# Altium schematic sheet ATmega324PB_Xplained_Pro_TopLevel.SchDoc: Top Level Schematics
size A3; Organization: ATMEL Norway; Address1: Vestre Rosten 79; Address2: N-7075 TILLER; Address3: NORWAY; DocumentNumber: A09-2589; Revision: 1; SheetNumber: 1; SheetTotal: 5; PageSetup: Record=PageOptions|CenterHorizontal=True|CenterVertical=True|PrintScale=1.01|XCorrection=1.00|YCorrection=1.00|PrintKind=1|BorderSize=5000000|LeftOffset=0|BottomOffset=0|Orientation=2|PaperLength=1000|PaperWidth=1000|Scale=100|PaperSource=7|PrintQuality=-4|MediaType=1|DitherType=10|PaperKind=Letter|PrintScaleMode=1
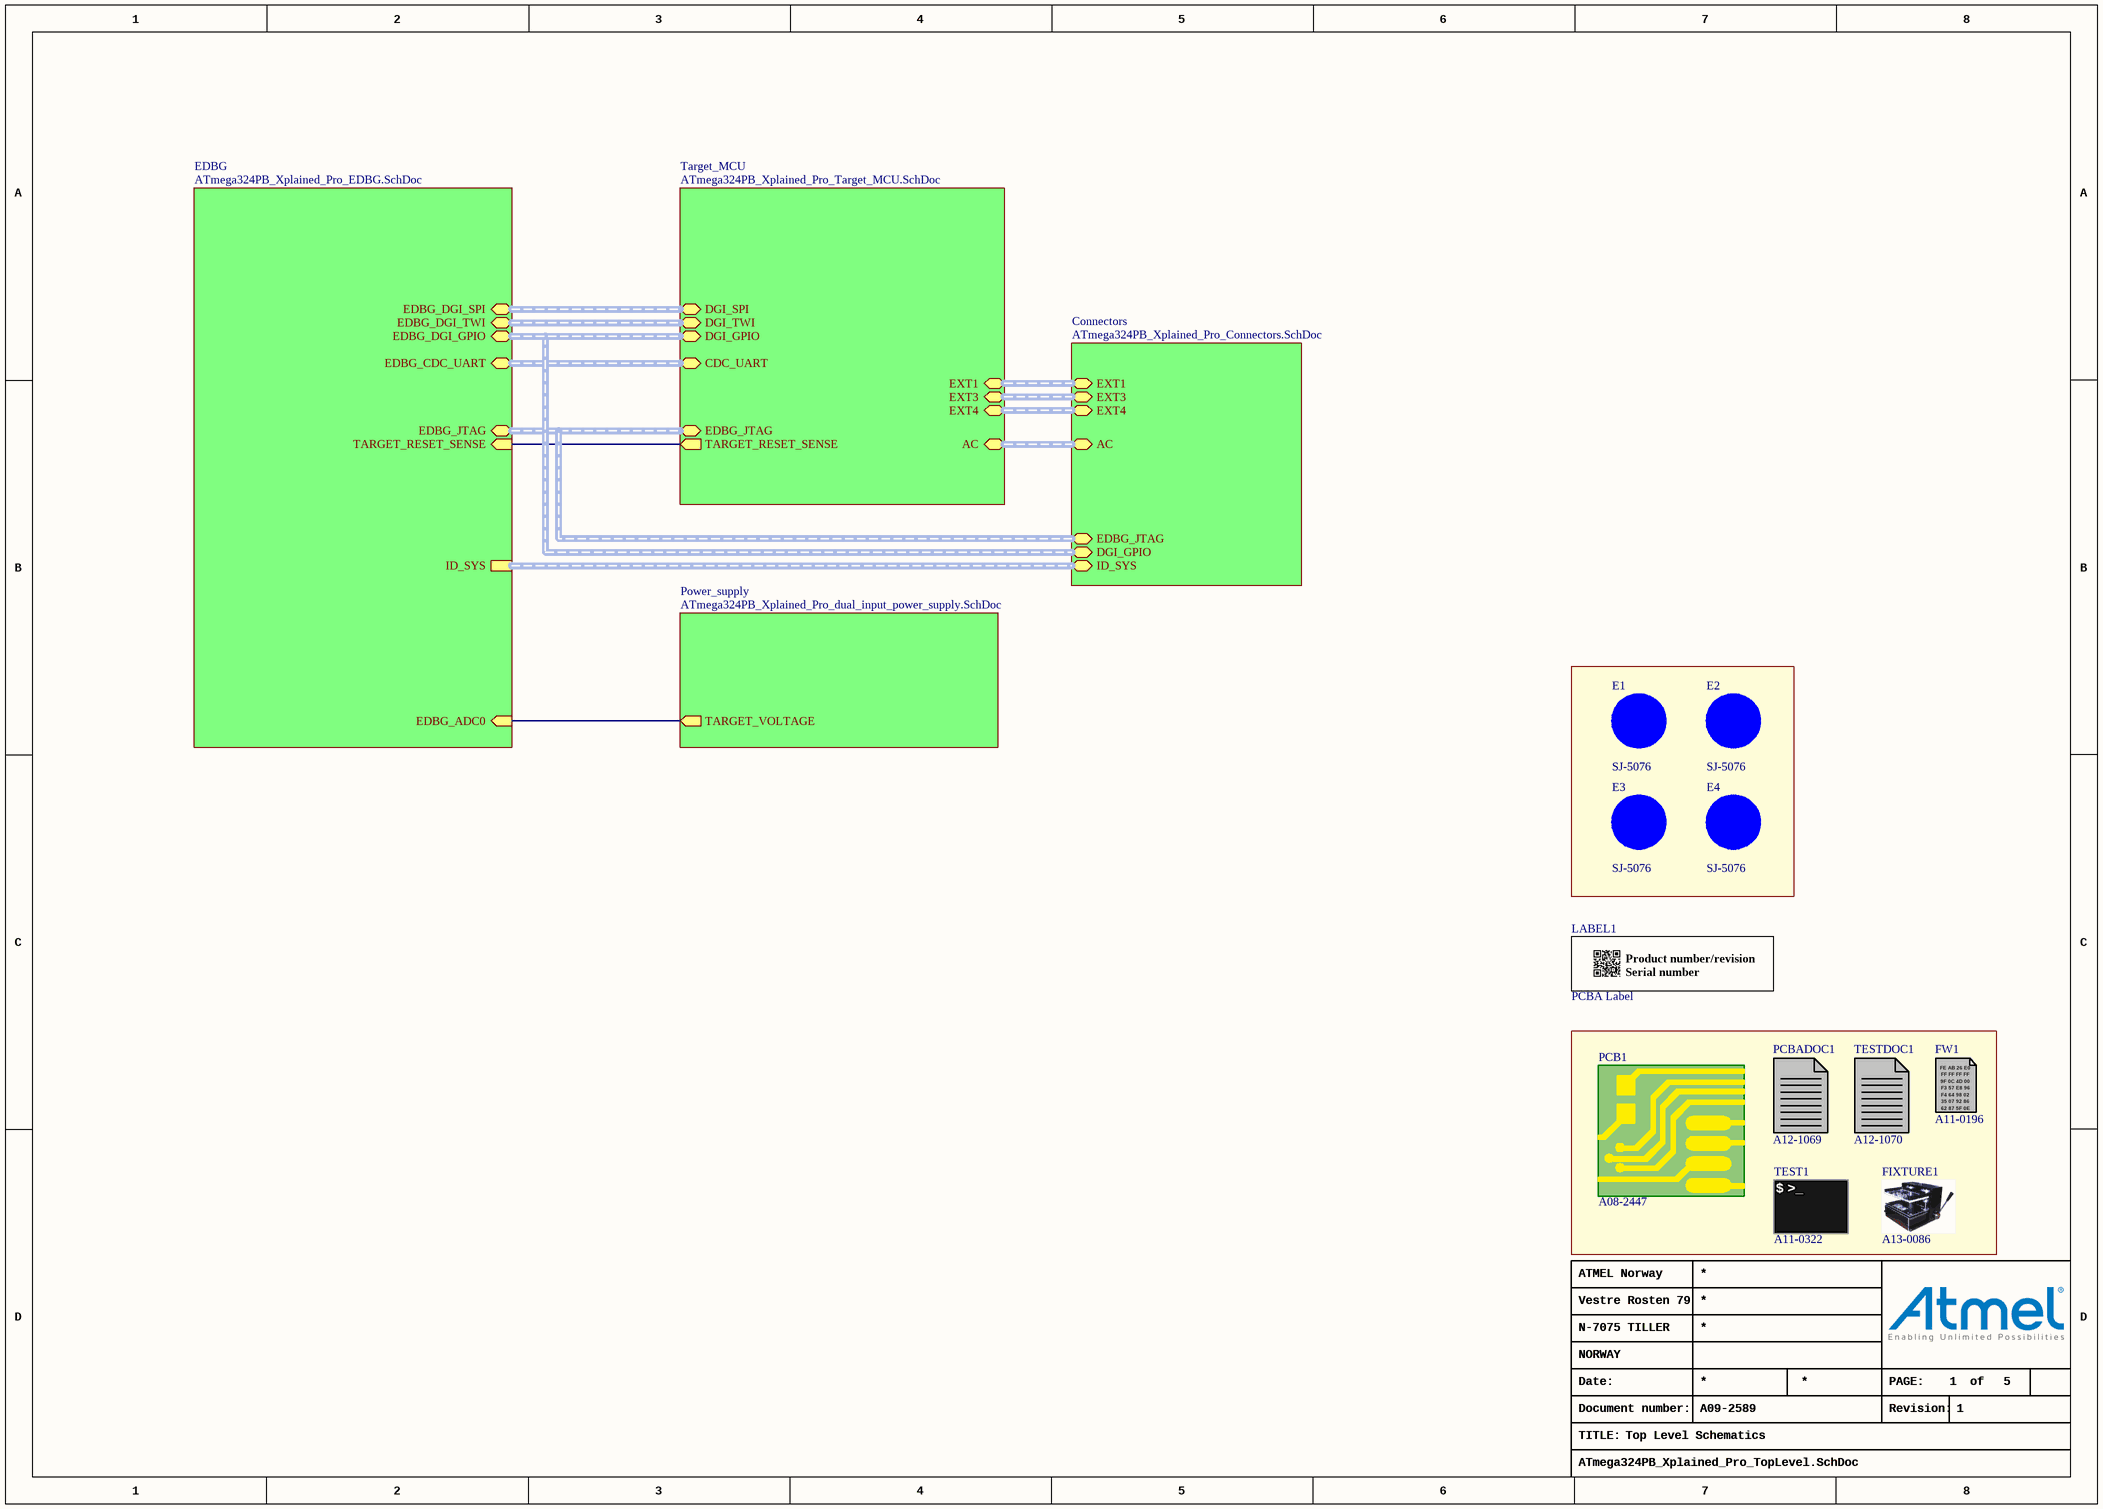
[diagram p0: ATmega324PB_Xplained_Pro_TopLevel.SchDoc]

## Parts
E1  value SJ-5076  [AP8-00192]
E2  value SJ-5076  [AP8-00192]
E3  value SJ-5076  [AP8-00192]
E4  value SJ-5076  [AP8-00192]
FIXTURE1  AN: A13-0086  (mechanical)
FW1  AN: A11-0196  (mechanical)
LABEL1  value PCBA Label  [AP8-00317]
PCB1  AN: A08-2447  (mechanical)
PCBADOC1  AN: A12-1069  (mechanical)
TEST1  AN: A11-0322  (mechanical)
TESTDOC1  AN: A12-1070  (mechanical)

## Sub-sheets
Connectors = ATmega324PB_Xplained_Pro_Connectors.SchDoc: ID_SYS (harness ID_SYS), EXT1 (harness EXT), EXT3 (harness EXT), EXT4 (harness EXT), DGI_GPIO (harness DGI_GPIO), AC (harness AC), EDBG_JTAG (harness JTAG)
EDBG = ATmega324PB_Xplained_Pro_EDBG.SchDoc: ID_SYS (harness ID_SYS), EDBG_CDC_UART (harness CDC_UART), EDBG_DGI_TWI (harness DGI_TWI), EDBG_DGI_SPI (harness DGI_SPI), EDBG_DGI_GPIO (harness DGI_GPIO), TARGET_RESET_SENSE (in), EDBG_ADC0 (in), EDBG_JTAG (harness JTAG)
Power_supply = ATmega324PB_Xplained_Pro_dual_input_power_supply.SchDoc: TARGET_VOLTAGE (out)
Target_MCU = ATmega324PB_Xplained_Pro_Target_MCU.SchDoc: DGI_SPI (harness DGI_SPI), DGI_TWI (harness DGI_TWI), DGI_GPIO (harness DGI_GPIO), CDC_UART (harness CDC_UART), TARGET_RESET_SENSE (out), EXT1 (harness EXT), EXT3 (harness EXT), EXT4 (harness EXT), AC (harness AC), EDBG_JTAG (harness JTAG)

## Nets
(unnamed): sheet Target_MCU/TARGET_RESET_SENSE, sheet EDBG/TARGET_RESET_SENSE
(unnamed): sheet EDBG/EDBG_ADC0, sheet Power_supply/TARGET_VOLTAGE

Not connected (* = marked no-connect by the designer): E1 1(FIDUCIAL); E2 1(FIDUCIAL); E3 1(FIDUCIAL); E4 1(FIDUCIAL)

## Buses and harness runs
harness sheet Connectors/AC = sheet Target_MCU/AC
harness sheet Connectors/DGI_GPIO = sheet EDBG/EDBG_DGI_GPIO = sheet Target_MCU/DGI_GPIO
harness sheet Connectors/EDBG_JTAG = sheet EDBG/EDBG_JTAG = sheet Target_MCU/EDBG_JTAG
harness sheet Connectors/EXT1 = sheet Target_MCU/EXT1
harness sheet Connectors/EXT3 = sheet Target_MCU/EXT3
harness sheet Connectors/EXT4 = sheet Target_MCU/EXT4
harness sheet Connectors/ID_SYS = sheet EDBG/ID_SYS
harness sheet EDBG/EDBG_CDC_UART = sheet Target_MCU/CDC_UART
harness sheet EDBG/EDBG_DGI_SPI = sheet Target_MCU/DGI_SPI
harness sheet EDBG/EDBG_DGI_TWI = sheet Target_MCU/DGI_TWI

## Notes on the sheet
- Date:
- PAGE:
- of
- TITLE:
- Document number:
- Revision:
- (in symbol A09-0611) / Product number/revision / Serial number
- (in symbol A11-0196) FE AB 26 E0; FF FF FF FF; 9F 0C 4D 00; F3 57 E8 96; F4 64 98 02; 35 07 92 86; 62 87 5F 0E
- (in symbol A11-0322) $ >_

## Library data of the parts
E1-E4 = A08-0053: 2.8mm adhesive feet,diam 8.0mm; PartGroup: Mechanical devices,Mounting accessories; Manufacturer: 3M; AN: A08-0053; Height: 2,79999995231628; MPN: SJ-5076
FIXTURE1 = A13-0086: Xplained PRO MCU board Jupiter Test Fixture; PartGroup: Test Equipment,Test Fixtures; Manufacturer: ESCATEC; Value: Xplained PRO MCU board Jupiter Test Fixture; MPN: Xplained PRO MCU board Jupiter Test Fixture
FW1 = A11-0196: EDBG secured firmware; PartGroup: Software,Firmware,Tools; Value: EDBG secured firmware
LABEL1 = A09-0611: PCBA identification label PP Top White Gloss; PartGroup: Mechanical devices,Packaging materials,Printed Labels; Manufacturer: ACT Logimark AS; MPN: 505462; AN: A09-0611
PCB1 = A08-2447: ATmega324PB_Xplained_Pro PCB documentation; PartGroup: Mechanical devices; Value: ATmega324PB_Xplained_Pro PCB documentation
PCBADOC1 = A12-1069: ATmega324PB Xplained Pro PCBA documentation; PartGroup: Documentation,PCBA Documents,Atmel; Value: A09-2589 PCBA Files
TEST1 = A11-0322: Fixture test for ATmega324PB Xplained Pro; PartGroup: Software,Test software,Starter Kit; Value: ATmega324PB Xplained Pro test
TESTDOC1 = A12-1070: ATmega324PB Xplained Pro Test Instructions; PartGroup: Documentation,Procedures,Test Instructions; Value: ATmega324PB Xplained Pro Test Instructions